# Altium schematic sheet 11-multimodal-accelerometer.SchDoc
size A; SheetNumber: 12; SheetTotal: 12
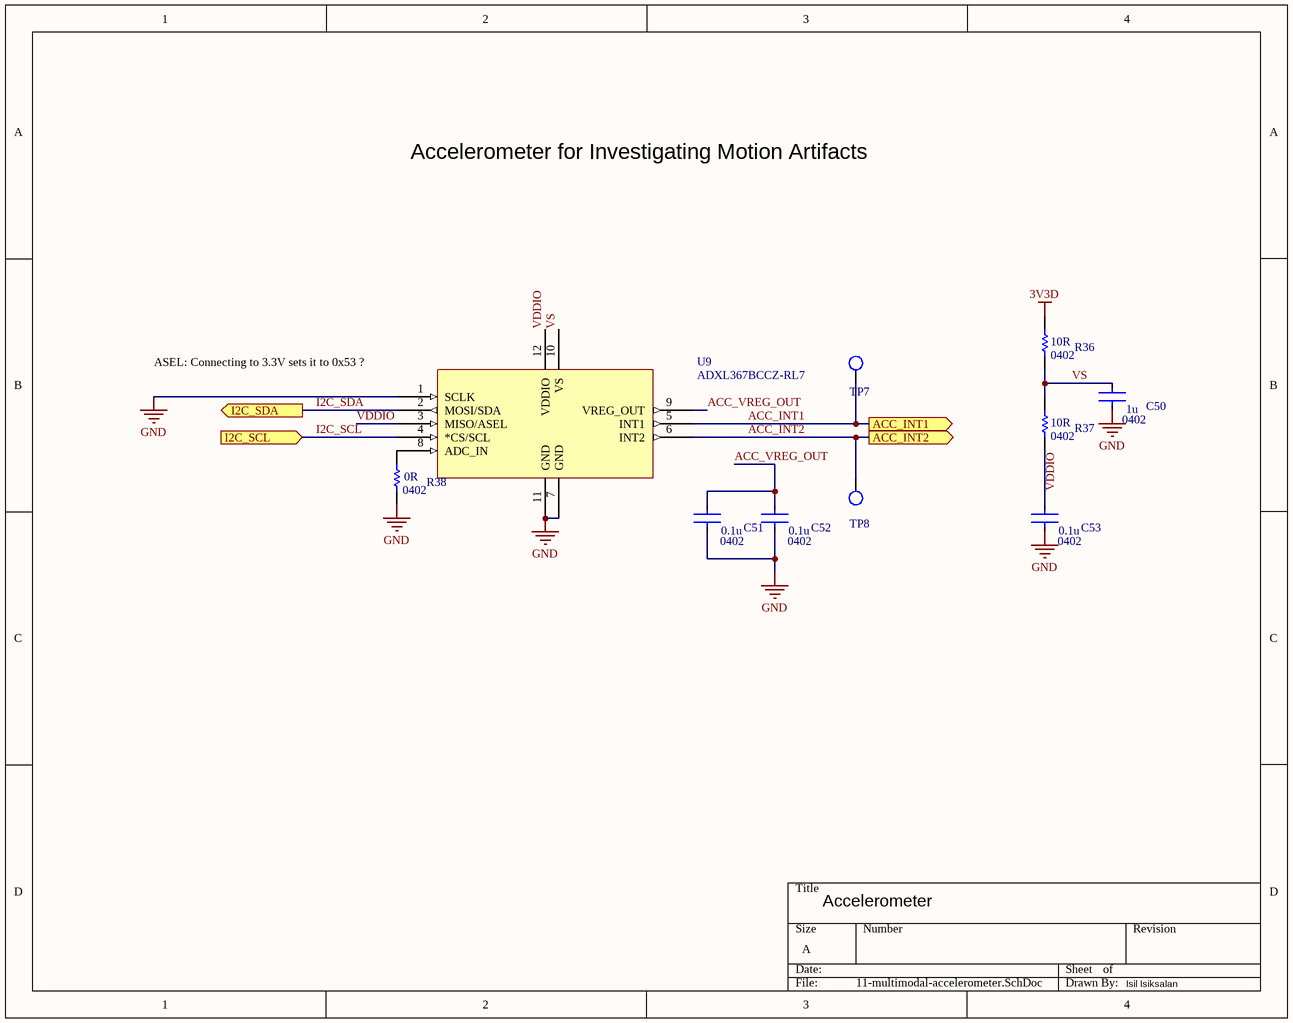
[diagram p0: 11-multimodal-accelerometer.SchDoc]

## Parts
C50  C1005X5R1V105K050BC  [CAPTDK0402]  (value not drawn)
C51  C1005X7R1H104K050BB  [CAPTDK0402]  (value not drawn)
C52  C1005X7R1H104K050BB  [CAPTDK0402]  (value not drawn)
C53  C1005X7R1H104K050BB  [CAPTDK0402]  (value not drawn)
R36  RMCF0402FT10R0  [RES-STACK-POLE-0402]  (value not drawn)
R37  RMCF0402FT10R0  [RES-STACK-POLE-0402]  (value not drawn)
R38  RMCF0402ZT0R00  [RES-STACK-POLE-0402]  (value not drawn)
TP7  TESTPOINT_S  [TESTPOINT_S]  (value not drawn)  (no BOM)
TP8  TESTPOINT_S  [TESTPOINT_S]  (value not drawn)  (no BOM)
U9  ADXL367BCCZ-RL7  [ADXL367BCCZ-RL7]

## Ports
ACC_INT1 (out), ACC_INT2 (out), I2C_SCL (in), I2C_SDA (out)

## Nets
3V3D: R36.2
GND: C50.2 C51.2 C52.2 C53.2 R38.1 U9.1(SCLK) U9.7(GND) U9.11(GND)
ACC_INT1: TP7.1 U9.5(INT1) ; port ACC_INT1
ACC_INT2: TP8.1 U9.6(INT2) ; port ACC_INT2
ACC_VREG_OUT: C51.1 C52.1 U9.9(VREG_OUT)
I2C_SCL: U9.4(*CS/SCL) ; port I2C_SCL
I2C_SDA: U9.2(MOSI/SDA) ; port I2C_SDA
VDDIO: U9.3(MISO/ASEL) U9.12(VDDIO)
VS: C50.1 R36.1 R37.2 U9.10(VS)
NetC53_1: C53.1 R37.1
NetR38_2: R38.2 U9.8(ADC_IN)

## Notes on the sheet
- Accelerometer for Investigating Motion Artifacts
- (near U9) ASEL: Connecting to 3.3V sets it to 0x53 ?
- Accelerometer
- Isil Isiksalan
- Labels drawn without touching a wire or pin: VDDIO
- (in symbol C1005X5R1V105K050BC) 1u; 0402
- (in symbol C1005X7R1H104K050BB) 0.1u; 0402
- (in symbol RMCF0402FT10R0) 10R; 0402
- (in symbol RMCF0402ZT0R00) 0R; 0402

## Library data of the parts
C50 = C1005X5R1V105K050BC: CAP CER 1UF 35V X5R 0402; Supplier 1: Digi-Key; Supplier Part Number 1: 445-9073-1-ND
C51-C53 = C1005X7R1H104K050BB: CAP CER 0.1UF 50V X7R 0402; Supplier 1: Digi-Key; Supplier Part Number 1: 445-5932-1-ND
R36 R37 = RMCF0402FT10R0: RES 10 OHM 1% 1/16W 0402; Supplier 1: Digi-Key; Supplier Part Number 1: RMCF0402FT10R0CT-ND
R38 = RMCF0402ZT0R00: RES 0 OHM JUMPER 1/16W 0402; Supplier 1: Digi-Key; Supplier Part Number 1: RMCF0402ZT0R00CT-ND
TP7 TP8 = TESTPOINT_S: Testpoint Surface Pad
U9 = ADXL367BCCZ-RL7: Accelerometer X, Y, Z Axis ±2g, 4g, 8g 6.25Hz ~ 200Hz 12-LGA (2.2x2.3); Manufacturer_Name: Analog Devices Inc; Type: Motion Sensors; Copyright: Copyright (C) 2025 Ultra Librarian. All rights reserved.; Manufacturer_Part_Number: ADXL367BCCZ-RL7; RefDes: RefDes; Supplier 1: DigiKey; Supplier Part Number 1: 505-ADXL367BCCZ-RL7CT-ND